# EAGLE design attiny45-microcontrol-v4.1-small (EAGLE 6.5.0)
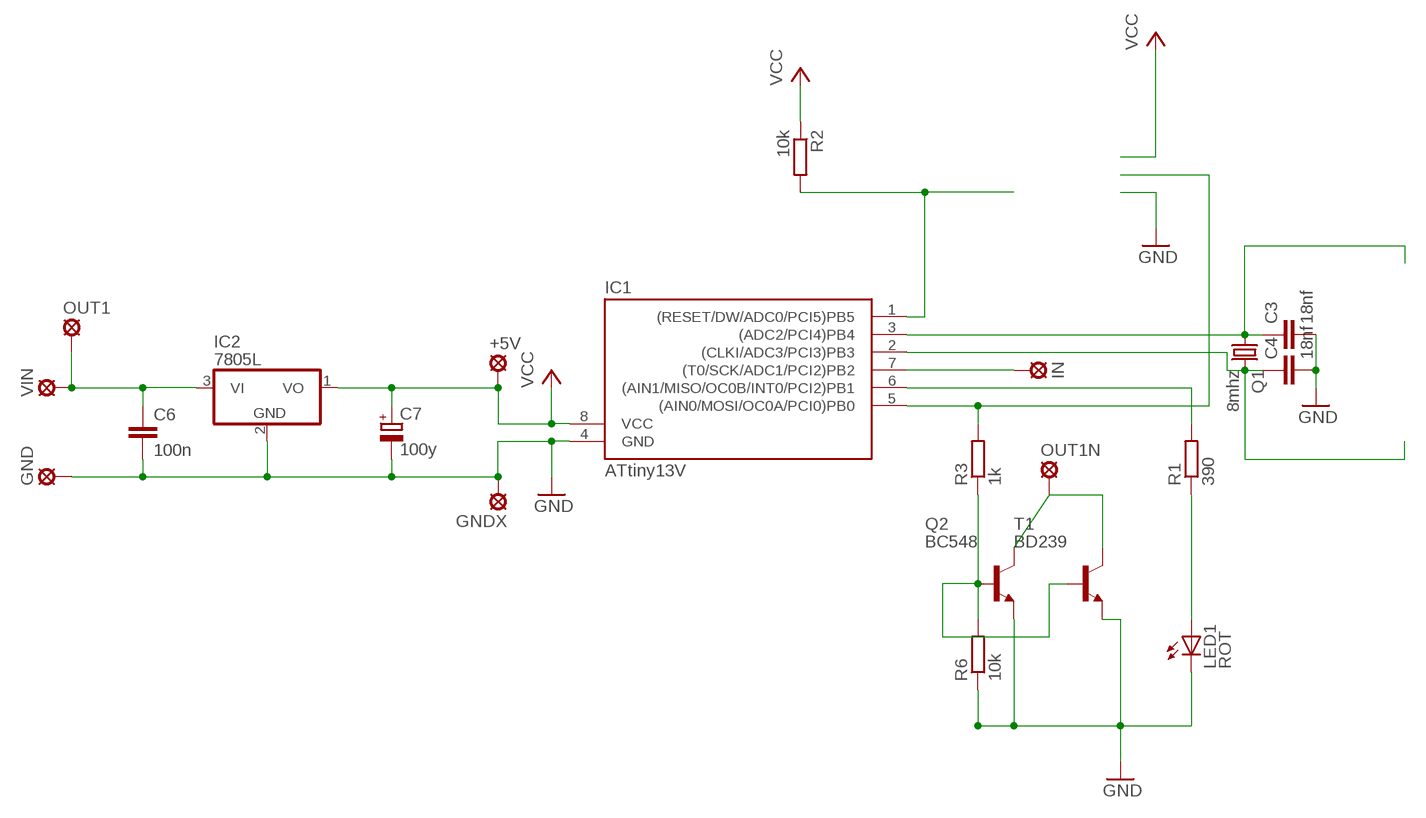
[diagram p0: schematic, sheet 1]

## Parts
+5V  LSP10  [LSP10]
C3  18nf  C5/2.5  [C5B2.5]
C4  18nf  C5/2.5  [C5B2.5]
C6  100n  C-EU050-035X075  [C050-035X075]
C7  100y  CPOL-EUE2.5-5  [E2,5-5]
GND  LSP10  [LSP10]
GNDX  LSP10  [LSP10]
IC1  ATtiny13V  ATTINY13-20P  [DIL08]
IC2  7805L  [TO92]
IN  LSP10  [LSP10]
LED1  ROT  LED3MM  [LED3MM]
OUT1  LSP10  [LSP10]
OUT1N  LSP10  [LSP10]
Q1  8mhz  CRYSTALHC18U-V  [HC18U-V]
Q2  BC548  [TO92-EBC]
R1  390  R-EU_0204/7  [0204/7]
R2  10k  R-EU_R1206  [R1206]
R3  1k  R-EU_0204/7  [0204/7]
R6  10k  R-EU_R1206  [R1206]
T1  BD239  [TO220]
VIN  LSP10  [LSP10]

## Nets
GND: C3.2 C4.2 C6.2 C7.- GND.MP GNDX.MP IC1.4(GND) IC2.2(GND) LED1.K(C) Q2.E R6.1 T1.3(E)
N$1: Q2.B R3.1 R6.2 T1.1(B)
N$2: C4.1 IC1.2((CLKI/ADC3/PCI3)PB3) Q1.2
N$3: IC1.1((RESET/DW/ADC0/PCI5)PB5) R2.2
N$4: IC1.7((T0/SCK/ADC1/PCI2)PB2) IN.MP
N$5: IC1.6((AIN1/MISO/OC0B/INT0/PCI2)PB1) R1.2
N$7: LED1.A R1.1
N$8: C3.1 IC1.3((ADC2/PCI4)PB4) Q1.1
N$10: IC1.5((AIN0/MOSI/OC0A/PCI0)PB0) R3.2
N$13: OUT1N.MP Q2.C T1.2(C)
N$14: C6.1 IC2.3(VI) OUT1.MP VIN.MP
VCC: +5V.MP C7.+ IC1.8(VCC) IC2.1(VO) R2.1

## Library data of the parts
+5V GND GNDX IN OUT1 OUT1N VIN = solpad:LSP10: SOLDER PAD drill 1.0 mm, distributor Buerklin, 12H555
C3 C4 = capacitor-wima:C: CAPACITOR naming: grid - package width
C6 = rcl:C-EU: CAPACITOR, European symbol
C7 = rcl:CPOL-EU: POLARIZED CAPACITOR, European symbol
IC1 = avr:ATTINY13: MICROCONTROLLER 1 Kbytes FLASH 64 bytes EEPROM 64 bytes RAM 4-channel 10 bit ADC
IC2 = linear:78*: Positive VOLTAGE REGULATOR Source: http://cache.national.com/ds/LM/LM78L05.pdf http://www.fairchildsemi.com/ds/LM/LM7805.pdf
LED1 = led:LED: LED OSRAM: - CHIPLED LG R971, LG N971, LY N971, LG Q971, LY Q971, LO R971, LY R971 LH N974, LH R974 LS Q976, LO Q976, LY Q976 LO Q996 - Hyper CHIPLED LW Q18S LB Q993, LB Q99A, LB R99A - SideLED LS A670, LO A670, LY A670, LG A670, LP A670 LB A673, LV A673, LT A673, LW A673 LH A674 LY A675 LS A676, LA A676, LO A676, LY A676, LW A676 LS A679, LY A679, LG A679 - Hyper Micro SIDELED® LS Y876, LA Y876, LO Y876, LY Y876 LT Y87S - SmartLED LW L88C, LW L88S LB L89C, LB L89S, LG L890 LS L89K, LO L89K, LY L89K LS L896, LA L896, LO L896, LY L896 - TOPLED LS T670, LO T670, LY T670, LG T670, LP T670 LSG T670, LSP T670, LSY T670, LOP T670, LYG T670 LG T671, LOG T671, LSG T671 LB T673, LV T673, LT T673, LW T673 LH T674 LS T676, LA T676, LO T676, LY T676, LB T676, LH T676, LSB T676, LW T676 LB T67C, LV T67C, LT T67C, LS T67K, LO T67K, LY T67K, LW E67C LS E67B, LA E67B, LO E67B, LY E67B, LB E67C, LV E67C, LT E67C LW T67C LS T679, LY T679, LG T679 LS T770, LO T770, LY T770, LG T770, LP T770 LB T773, LV T773, LT T773, LW T773 LH T774 LS E675, LA E675, LY E675, LS T675 LS T776, LA T776, LO T776, LY T776, LB T776 LHGB T686 LT T68C, LB T68C - Hyper Mini TOPLED® LB M676 - Mini TOPLED Santana® LG M470 LS M47K, LO M47K, LY M47K Source: http://www.osram.convergy.de LUXEON: - LUMILED® LXK2-PW12-R00, LXK2-PW12-S00, LXK2-PW14-U00, LXK2-PW14-V00 LXK2-PM12-R00, LXK2-PM12-S00, LXK2-PM14-U00 LXK2-PE12-Q00, LXK2-PE12-R00, LXK2-PE12-S00, LXK2-PE14-T00, LXK2-PE14-U00 LXK2-PB12-K00, LXK2-PB12-L00, LXK2-PB12-M00, LXK2-PB14-N00, LXK2-PB14-P00, LXK2-PB14-Q00 LXK2-PR12-L00, LXK2-PR12-M00, LXK2-PR14-Q00, LXK2-PR14-R00 LXK2-PD12-Q00, LXK2-PD12-R00, LXK2-PD12-S00 LXK2-PH12-R00, LXK2-PH12-S00 LXK2-PL12-P00, LXK2-PL12-Q00, LXK2-PL12-R00 Source: www.luxeon.com KINGBRIGHT: KA-3528ASYC Source: www.kingbright.com
Q1 = crystal:CRYSTAL: CRYSTAL; OC_FARNELL: unknown; OC_NEWARK: unknown
Q2 = transistor-npn:BC548*: NPN Transistor
R1-R3 R6 = rcl:R-EU_: RESISTOR, European symbol
T1 = transistor:BD239: NPN TRANSISTOR Source: http://www.fairchildsemi.com/ds/BD/BD239C.pdf

## Net classes
0 default: clearance 0.355 mm

## Board
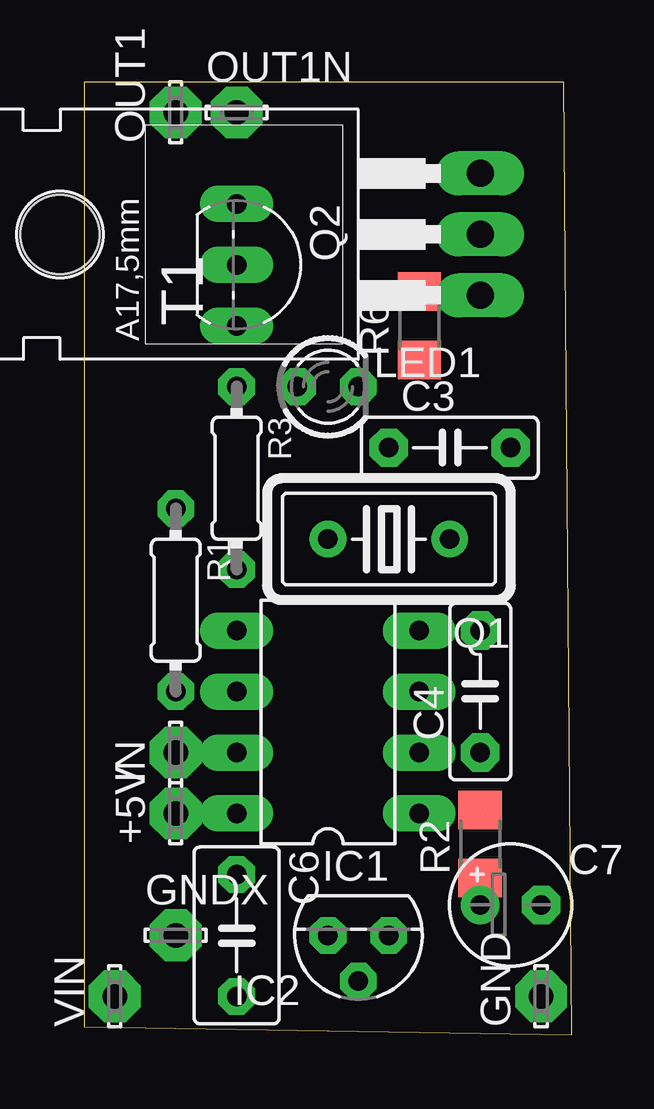
[diagram p1: board, top side]
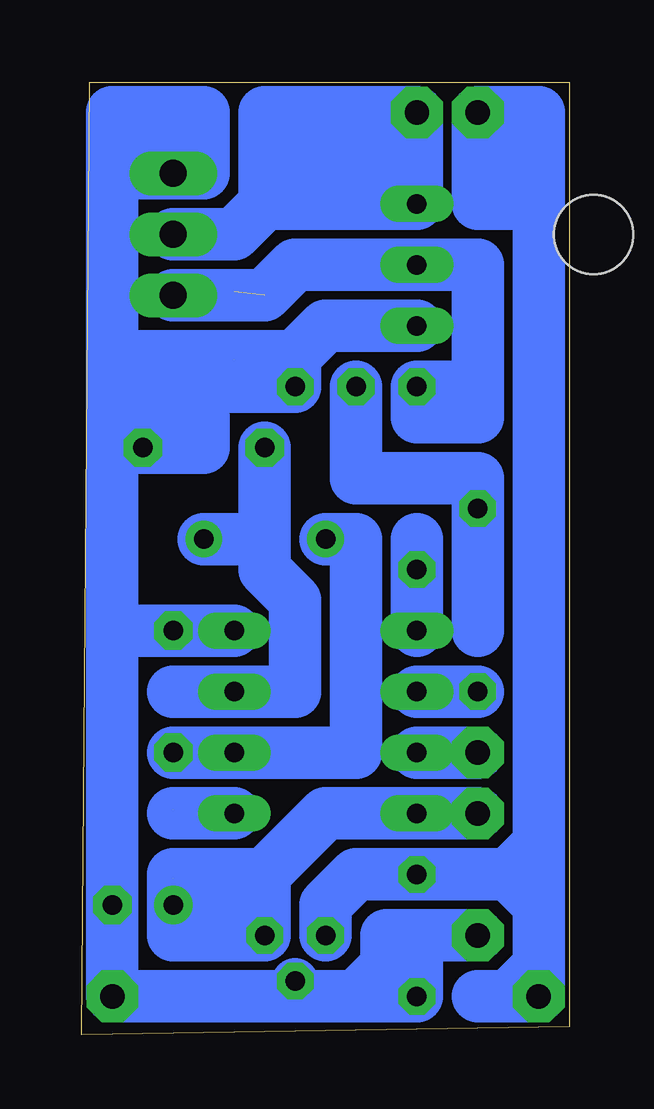
[diagram p2: board, bottom side, seen from below]

Size 20.32 x 39.69 mm. Coordinates in mm from the lower left corner, seen from the top.
Outline: 0,0.33 20.32,0 19.99,39.69 0,39.69 0,0.33
Copper layers (1*16): Top 0.035mm / dielectric 1.5mm / Bottom 0.035mm
Design rules "default *": minimum track width 10mil, minimum drill 24mil, track to track 8mil, track to pad 8mil, pad to pad 8mil, via to via 8mil, smd to smd 8mil, copper to edge 40mil, drill to drill 8mil, minimum pad ring 14mil, minimum via ring 10mil, stop-mask expansion 4mil, vias tented up to drill 0mil, thermal gap 10mil

### Footprints (pad centres in the part's own frame; a part is rotated, then mirrored left to right if it is on the bottom)
LSP10 = drill 1.016 pad 2.159 octagon: MP 0,0
C5B2.5 = drill 0.813 pad 1.6 octagon: 1 -2.54,0; 2 2.54,0
C050-035X075 = drill 0.813 octagon: 1 -2.54,0; 2 2.54,0
E2,5-5 = drill 0.813 pad 1.6: + -1.27,0 | drill 0.813 pad 1.6 octagon: - 1.27,0
DIL08 = drill 0.813 long: 1 -3.81,-3.81; 2 -1.27,-3.81; 3 1.27,-3.81; 4 3.81,-3.81; 5 3.81,3.81; 6 1.27,3.81; 7 -1.27,3.81; 8 -3.81,3.81
TO92 = drill 0.813 octagon: 1 -1.27,0; 2 0,1.905; 3 1.27,0
LED3MM = drill 0.813 octagon: A -1.27,0; K 1.27,0
HC18U-V = drill 0.813: 1 -2.54,0; 2 2.54,0
TO92-EBC = drill 0.813 long: B 0,-1.27; C -2.54,-1.27; E 2.54,-1.27
0204/7 = drill 0.813 octagon: 1 -3.81,0; 2 3.81,0
R1206 = smd 1.6 x 1.803: 1 -1.422,0; 2 1.422,0
TO220 = drill 1.118 long: 1 -2.54,-6.35; 2 0,-6.35; 3 2.54,-6.35 | hole 3.302: 0,11.176

### Placement (x,y rotation side)
+5V  3.81,9.22 90 top
C3  15.24,24.46 0 top
C4  16.51,14.3 90 top
C6  6.35,4.14 270 top
C7  17.78,5.41 0 top
GND  19.05,1.6 90 top
GNDX  3.81,4.14 0 top
IC1  10.16,13.03 90 top
IC2  11.43,4.14 180 top
IN  3.81,11.76 90 top
LED1  10.16,27 0 top
OUT1  3.81,38.43 90 top
OUT1N  6.35,38.43 0 top
Q1  12.7,20.65 180 top
Q2  7.62,32.08 270 top
R1  3.81,18.11 270 top
R2  16.51,7.95 90 top
R3  6.35,23.19 270 top
R6  13.97,29.54 90 top
T1  10.16,33.35 90 top
VIN  1.27,1.6 90 top

### Tracks (layer width: path | path; a pad name or v marks a point on that pad's centre or on a via)
GND  (1 unrouted)
  Bottom 1.778: 13.97,27 R6.1 | 16.51,37.16 17.78,37.16 19.05,38.43
  Bottom 1.93: 11.43,1.6 IC2.2
  Bottom 2.184: 8.89,1.6 C6.2 6.35,4.14 | 8.89,1.6 11.43,1.6 GND.MP C7.- 19.05,16.84 | 19.05,16.84 C4.2 IC1.4 | 19.05,16.84 19.05,24.46 | 19.05,24.46 C3.2 15.24,24.46 15.24,25.73 17.78,25.73 | 19.05,24.46 19.05,27 | Q2.E 10.16,29.54 11.43,28.27 | 11.43,28.27 LED1.K 13.97,27 19.05,27 | 19.05,35.89 T1.3 15.24,35.89 15.24,38.43 19.05,38.43 19.05,37.16 | 19.05,35.89 19.05,28.27 | 19.05,28.27 19.05,27 | 11.43,28.27 19.05,28.27 | GNDX.MP 6.35,4.14 | 8.89,1.6 7.62,2.87 7.62,4.14 6.35,4.14 | 19.05,37.16 17.78,37.16 | 19.05,37.16 19.05,35.89
N$1  (1 unrouted)
  Bottom 2.184: 3.81,27 R3.1 6.35,25.73 3.81,25.73 3.81,27 | 3.81,27 3.81,32.08 Q2.B 11.43,32.08 12.7,30.81 T1.1
N$2
  Bottom 2.184: C4.1 IC1.2 8.89,11.76 8.89,20.65 Q1.2
N$3  (1 unrouted)
  Bottom 1.778: 16.51,9.22 R2.2
  Bottom 2.184: IC1.1 16.51,9.22
N$4
  Bottom 2.184: IC1.7 IN.MP
N$5
  Bottom 2.184: IC1.6 R1.2
N$7
  Bottom 2.184: LED1.A 8.89,23.19 3.81,23.19 R1.1 3.81,16.84
N$8
  Bottom 2.184: 12.7,20.65 12.7,19.38 11.43,18.11 11.43,14.3 IC1.3 16.51,14.3 | Q1.1 12.7,20.65 | 12.7,20.65 C3.1
N$10
  Bottom 2.184: IC1.5 R3.2 6.35,20.65
N$13
  Bottom 1.778: 7.62,34.62 7.62,37.16 | 11.43,35.89 8.89,35.89
  Bottom 2.184: 12.7,34.62 13.97,33.35 T1.2 | 12.7,34.62 12.7,38.43 OUT1N.MP Q2.C 7.62,34.62 12.7,34.62 | 7.62,37.16 11.43,37.16 11.43,35.89
N$14
  Bottom 1.778: 2.54,6.68 1.27,6.68
  Bottom 2.184: IC2.3 10.16,5.41 8.89,6.68 C6.1 2.54,6.68 | 1.27,2.87 VIN.MP 2.54,1.6 | 1.27,2.87 1.27,5.41 | 1.27,5.41 1.27,6.68 1.27,7.95 | 1.27,7.95 1.27,34.62 | 1.27,34.62 OUT1.MP | 1.27,34.62 3.81,34.62 OUT1.MP | OUT1.MP 1.27,38.43 1.27,34.62 | 3.81,1.6 2.54,1.6 | 2.54,1.6 1.27,2.87 | 1.27,5.41 2.54,6.68 | 2.54,6.68 1.27,7.95
VCC  (1 unrouted)
  Bottom 1.778: 13.97,6.68 13.97,5.41
  Bottom 2.184: R2.1 C7.+ 16.51,4.14 IC2.1 12.7,6.68 | +5V.MP IC1.8 10.16,9.22 12.7,6.68 | 16.51,6.68 13.97,6.68 12.7,6.68 | 13.97,5.41 15.24,5.41